# Altium schematic sheet Connectors.SchDoc
size B; SheetNumber: 4; SheetTotal: 7
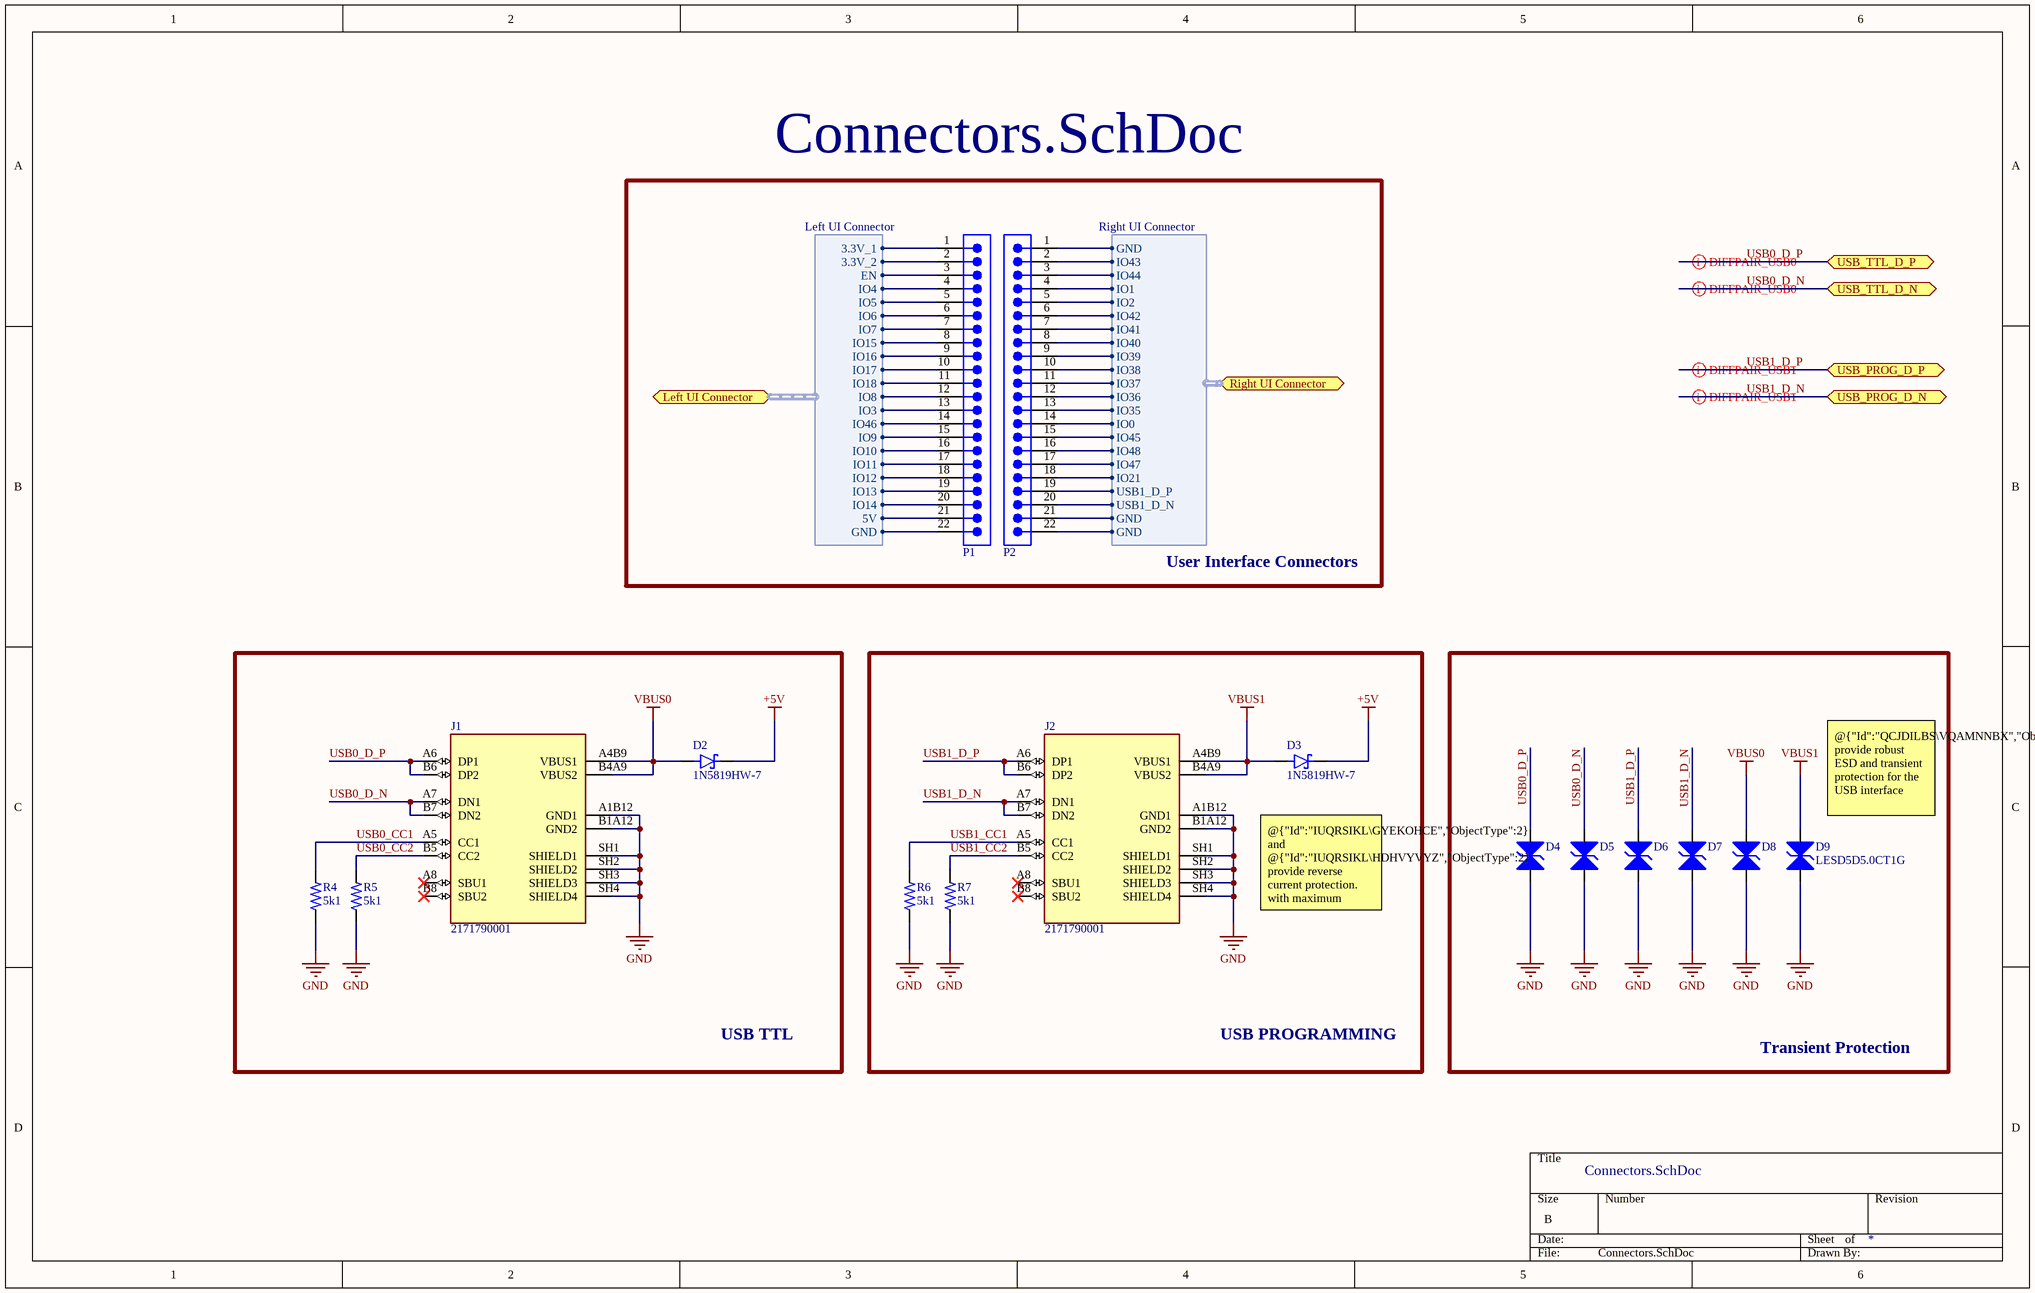
[diagram p0: Connectors.SchDoc]

## Parts
D2  1N5819HW-7  [SOD3715X145N]
D3  1N5819HW-7  [SOD3715X145N]
D4  LESD5D5.0CT1G  [TVS_LESD5D5.0CT1G]  (value not drawn)
D5  LESD5D5.0CT1G  [TVS_LESD5D5.0CT1G]  (value not drawn)
D6  LESD5D5.0CT1G  [TVS_LESD5D5.0CT1G]  (value not drawn)
D7  LESD5D5.0CT1G  [TVS_LESD5D5.0CT1G]  (value not drawn)
D8  LESD5D5.0CT1G  [TVS_LESD5D5.0CT1G]  (value not drawn)
D9  LESD5D5.0CT1G  [TVS_LESD5D5.0CT1G]
J1  2171790001  [MOLEX_2171790001]
J2  2171790001  [MOLEX_2171790001]
P1  61302211121  [61302211121]  (value not drawn)
P2  61302211121  [61302211121]  (value not drawn)
R4  5k1  [0402 RES]
R5  5k1  [0402 RES]
R6  5k1  [0402 RES]
R7  5k1  [0402 RES]

## Blocks framed on the sheet
User Interface Connectors: P1 P2
USB TTL: D2 J1 R4 R5
USB PROGRAMMING: D3 J2 R6 R7
Transient Protection: D4-D9

## Ports
Left UI Connector (bidir, harness Left UI Connector, see Master[3B], ESP32-S3-WROOM[4B]), Right UI Connector (bidir, harness Right UI Connector, see Master[3B], ESP32-S3-WROOM[4C]), USB_PROG_D_N (bidir, see Master[3C]), USB_PROG_D_P (bidir, see Master[3C]), USB_TTL_D_N (bidir, see Master[3C]), USB_TTL_D_P (bidir, see Master[3C])

## Harnesses
Right UI Connector: GND, IO43, IO44, IO1, IO2, IO35, IO36, IO37, IO38, IO39, IO40, IO41, IO42, IO0, IO45, IO48, IO47, USB1_D_N, USB1_D_P, IO21, GND, GND
Left UI Connector: 3.3V_1, 3.3V_2, EN, IO4, IO5, IO6, IO7, IO15, IO16, IO17, IO18, IO8, IO3, IO46, IO9, IO10, IO11, IO12, IO13, IO14, 5V, GND

## Nets
+5V: D2.C(K) D3.C(K)
GND: D4.1 D5.1 D6.1 D7.1 D8.1 D9.1 J1.A1B12(GND1) J1.B1A12(GND2) J1.SH1(SHIELD1) J1.SH2(SHIELD2) J1.SH3(SHIELD3) J1.SH4(SHIELD4) J2.A1B12(GND1) J2.B1A12(GND2) J2.SH1(SHIELD1) J2.SH2(SHIELD2) J2.SH3(SHIELD3) J2.SH4(SHIELD4) R4.1 R5.1 R6.1 R7.1
VBUS0: D2.A D8.2 J1.A4B9(VBUS1) J1.B4A9(VBUS2)
VBUS1: D3.A D9.2 J2.A4B9(VBUS1) J2.B4A9(VBUS2)
USB0_CC1: J1.A5(CC1) R4.2
USB0_CC2: J1.B5(CC2) R5.2
USB0_D_N: D5.2 J1.A7(DN1) J1.B7(DN2) ; port USB_TTL_D_N
USB0_D_P: D4.2 J1.A6(DP1) J1.B6(DP2) ; port USB_TTL_D_P
USB1_CC1: J2.A5(CC1) R6.2
USB1_CC2: J2.B5(CC2) R7.2
USB1_D_N: D7.2 J2.A7(DN1) J2.B7(DN2) ; port USB_PROG_D_N
USB1_D_P: D6.2 J2.A6(DP1) J2.B6(DP2) ; port USB_PROG_D_P
NetP1_1: P1.1 ; port Left UI Connector.3.3V_1
NetP1_2: P1.2 ; port Left UI Connector.3.3V_2
NetP1_3: P1.3 ; port Left UI Connector.EN
NetP1_4: P1.4 ; port Left UI Connector.IO4
NetP1_5: P1.5 ; port Left UI Connector.IO5
NetP1_6: P1.6 ; port Left UI Connector.IO6
NetP1_7: P1.7 ; port Left UI Connector.IO7
NetP1_8: P1.8 ; port Left UI Connector.IO15
NetP1_9: P1.9 ; port Left UI Connector.IO16
NetP1_10: P1.10 ; port Left UI Connector.IO17
NetP1_11: P1.11 ; port Left UI Connector.IO18
NetP1_12: P1.12 ; port Left UI Connector.IO8
NetP1_13: P1.13 ; port Left UI Connector.IO3
NetP1_14: P1.14 ; port Left UI Connector.IO46
NetP1_15: P1.15 ; port Left UI Connector.IO9
NetP1_16: P1.16 ; port Left UI Connector.IO10
NetP1_17: P1.17 ; port Left UI Connector.IO11
NetP1_18: P1.18 ; port Left UI Connector.IO12
NetP1_19: P1.19 ; port Left UI Connector.IO13
NetP1_20: P1.20 ; port Left UI Connector.IO14
NetP1_21: P1.21 ; port Left UI Connector.5V
NetP1_22: P1.22 ; port Left UI Connector.GND
NetP2_1: P2.1 P2.21 P2.22 ; port Right UI Connector.GND
NetP2_2: P2.2 ; port Right UI Connector.IO43
NetP2_3: P2.3 ; port Right UI Connector.IO44
NetP2_4: P2.4 ; port Right UI Connector.IO1
NetP2_5: P2.5 ; port Right UI Connector.IO2
NetP2_6: P2.6 ; port Right UI Connector.IO42
NetP2_7: P2.7 ; port Right UI Connector.IO41
NetP2_8: P2.8 ; port Right UI Connector.IO40
NetP2_9: P2.9 ; port Right UI Connector.IO39
NetP2_10: P2.10 ; port Right UI Connector.IO38
NetP2_11: P2.11 ; port Right UI Connector.IO37
NetP2_12: P2.12 ; port Right UI Connector.IO36
NetP2_13: P2.13 ; port Right UI Connector.IO35
NetP2_14: P2.14 ; port Right UI Connector.IO0
NetP2_15: P2.15 ; port Right UI Connector.IO45
NetP2_16: P2.16 ; port Right UI Connector.IO48
NetP2_17: P2.17 ; port Right UI Connector.IO47
NetP2_18: P2.18 ; port Right UI Connector.IO21
NetP2_19: P2.19 ; port Right UI Connector.USB1_D_P
NetP2_20: P2.20 ; port Right UI Connector.USB1_D_N

Not connected (* = marked no-connect by the designer): J1 A8(SBU1)* B8(SBU2)*; J2 A8(SBU1)* B8(SBU2)*

## Layout directives
differential pair; differential pair class DIFFPAIR_USB: USB0_D_N, USB0_D_P, USB1_D_N, USB1_D_P

## Notes on the sheet
- (near D9) @{"Id":"QCJDILBS\VQAMNNBX","ObjectType":2}:@{"Id":"QCJDILBS\IDLQJVSX","ObjectType":2} provide robust ESD and transient protection for the USB interface
- @{"Id":"IUQRSIKL\GYEKOHCE","ObjectType":2} and @{"Id":"IUQRSIKL\HDHVYVYZ","ObjectType":2} provide reverse current protection. with maximum forward voltage 0.75V

## Library data of the parts
D2 D3 = 1N5819HW-7: Diode Schottky 40 V 1A Surface Mount SOD-123; MF: Diodes Inc.; SnapEDA_Link: https://www.snapeda.com/parts/1N5819HW-7/Diodes+Inc./view-part/?ref=snap; Price: None; Check_prices: https://www.snapeda.com/parts/1N5819HW-7/Diodes+Inc./view-part/?ref=eda; Availability: In Stock; Value: *; MP: 1N5819HW-7; Package: SOD-123 Fairchild Semiconductor; Purchase-URL: https://pricing.snapeda.com/search/part/1N5819HW-7/?ref=eda
D4-D9 = LESD5D5.0CT1G: Transient Voltage Suppressors for ESD Protection; MF: Leshan Radio Co.; Check_prices: https://www.snapeda.com/parts/LESD5D5.0CT1G/Leshan+Radio+Co./view-part/?ref=eda; Value: *; Availability: Not in stock; Package: None; SnapEDA_Link: https://www.snapeda.com/parts/LESD5D5.0CT1G/Leshan+Radio+Co./view-part/?ref=snap; MP: LESD5D5.0CT1G; Price: None
J1 J2 = 2171790001: USB Type C - Connector, Top-mount SMT, 16pos | Molex Incorporated 217179-0001; SnapEDA_Link: https://www.snapeda.com/parts/217179-0001/Molex/view-part/?ref=snap; Package: None; Value: *; MF: Molex; MP: 217179-0001; Check_prices: https://www.snapeda.com/parts/217179-0001/Molex/view-part/?ref=eda
P1 P2 = 61302211121: WR-PHD Pin Header, THT, Vertical, pitch 2.54mm, 1 Row, 22P; Manufacturer: Wurth Elektronik; Contact Resistance: 20mOhm; Rated Current: 3A; Working Voltage: 250V; Withstanding Voltage: 500V; Manufacturer Part Number: 61302211121; Category: Board-to-Board Connectors; Match Code: WR-PHD; ComponentLink1Description: Website Link; ComponentLink1URL: https://www.we-online.com/redexpert/article/61302211121?ad; ComponentLink2Description: Datasheet Link; ComponentLink2URL: https://www.we-online.com/redexpert/spec/61302211121?ad; Mount: Through Hole; Operating Temperature Max: 105°C; Operating Temperature Min: -40°C; Packaging: Bag; Gender: Pin Header; Number of Pins: 22; Number of Rows: 1; Orientation: Vertical; Pitch: 2.54mm
R4-R7 = 0402 SMD Resistor: General Purpose Chip Resistor Thick Film 0402 5.1kOhm 1% Paper T/R; Manufacturer: Yageo; Manufacturer Part Number: RC0402FR-7W5K1L; Value: 5.1kR; ComponentLink1Description: Link; ComponentLink1URL: *; Supplier: Digikey; Supplier Part Number: 13-RC0402FR-7W5K1LCT-ND; RoHS: Yes; Category: Chip SMD Resistors; Stock: 6352; Pricing: 1=0.1, 10=0.021, 50=0.0164, 100=0.0112, 500=0.00868, 1000=0.00612, 5000=0.0051 (USD); Case/Package: 343Case; Packaging: 10Packaging; RoHS Compliant: Yes